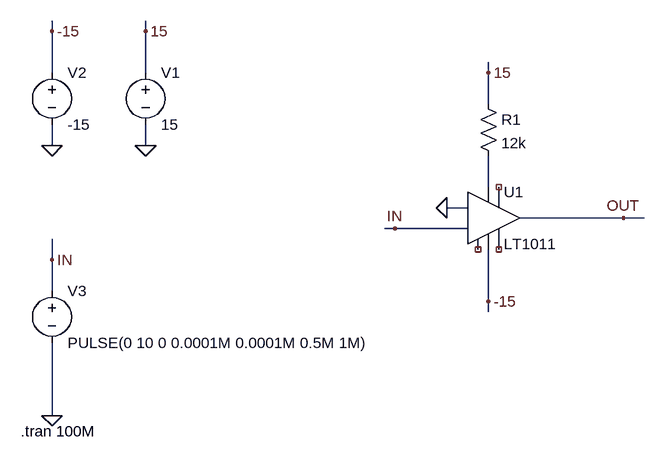
[diagram p0: schematic OpenComparator.asc]
OpenComparator.asc, the LTspice schematic file:
Version 4
SHEET 1 880 680
WIRE -272 -304 -272 -320
WIRE -128 -304 -128 -320
WIRE -272 -240 -272 -304
WIRE -128 -240 -128 -304
WIRE 400 -240 400 -256
WIRE 400 -192 400 -240
WIRE -272 -128 -272 -160
WIRE -128 -128 -128 -160
WIRE 400 -64 400 -112
WIRE 368 -32 336 -32
WIRE 608 -16 448 -16
WIRE 640 -16 608 -16
WIRE 256 0 240 0
WIRE 368 0 256 0
WIRE -272 48 -272 16
WIRE -272 96 -272 48
WIRE 400 112 400 32
WIRE 400 128 400 112
WIRE -272 288 -272 176
FLAG 336 -32 0
FLAG 608 -16 OUT
FLAG 256 0 IN
FLAG 400 -240 15
FLAG 400 112 -15
FLAG -128 -128 0
FLAG -272 -128 0
FLAG -128 -304 15
FLAG -272 -304 -15
FLAG -272 288 0
FLAG -272 48 IN
SYMBOL voltage -128 -256 R0
WINDOW 123 0 0 Left 2
WINDOW 39 0 0 Left 2
SYMATTR InstName V1
SYMATTR Value 15
SYMBOL voltage -272 -256 R0
WINDOW 123 0 0 Left 2
WINDOW 39 0 0 Left 2
SYMATTR InstName V2
SYMATTR Value -15
SYMBOL voltage -272 80 R0
WINDOW 123 0 0 Left 2
WINDOW 39 0 0 Left 2
SYMATTR InstName V3
SYMATTR Value PULSE(0 10 0 0.0001M 0.0001M 0.5M 1M)
SYMBOL res 384 -208 R0
SYMATTR InstName R1
SYMATTR Value 12k
SYMBOL Comparators\\LT1011 400 -16 R0
SYMATTR InstName U1
TEXT -320 312 Left 2 !.tran 100M

The netlist it stands for:
* OpenComparator.asc
V1 15 0 15
V2 -15 0 -15
V3 IN 0 PULSE(0 10 0 0.0001M 0.0001M 0.5M 1M)
R1 15 N001 12k
XU1 NC_01 IN 0 -15 NC_02 NC_03 OUT N001 LT1011
.tran 100M
.lib LTC1.lib
.backanno
.end